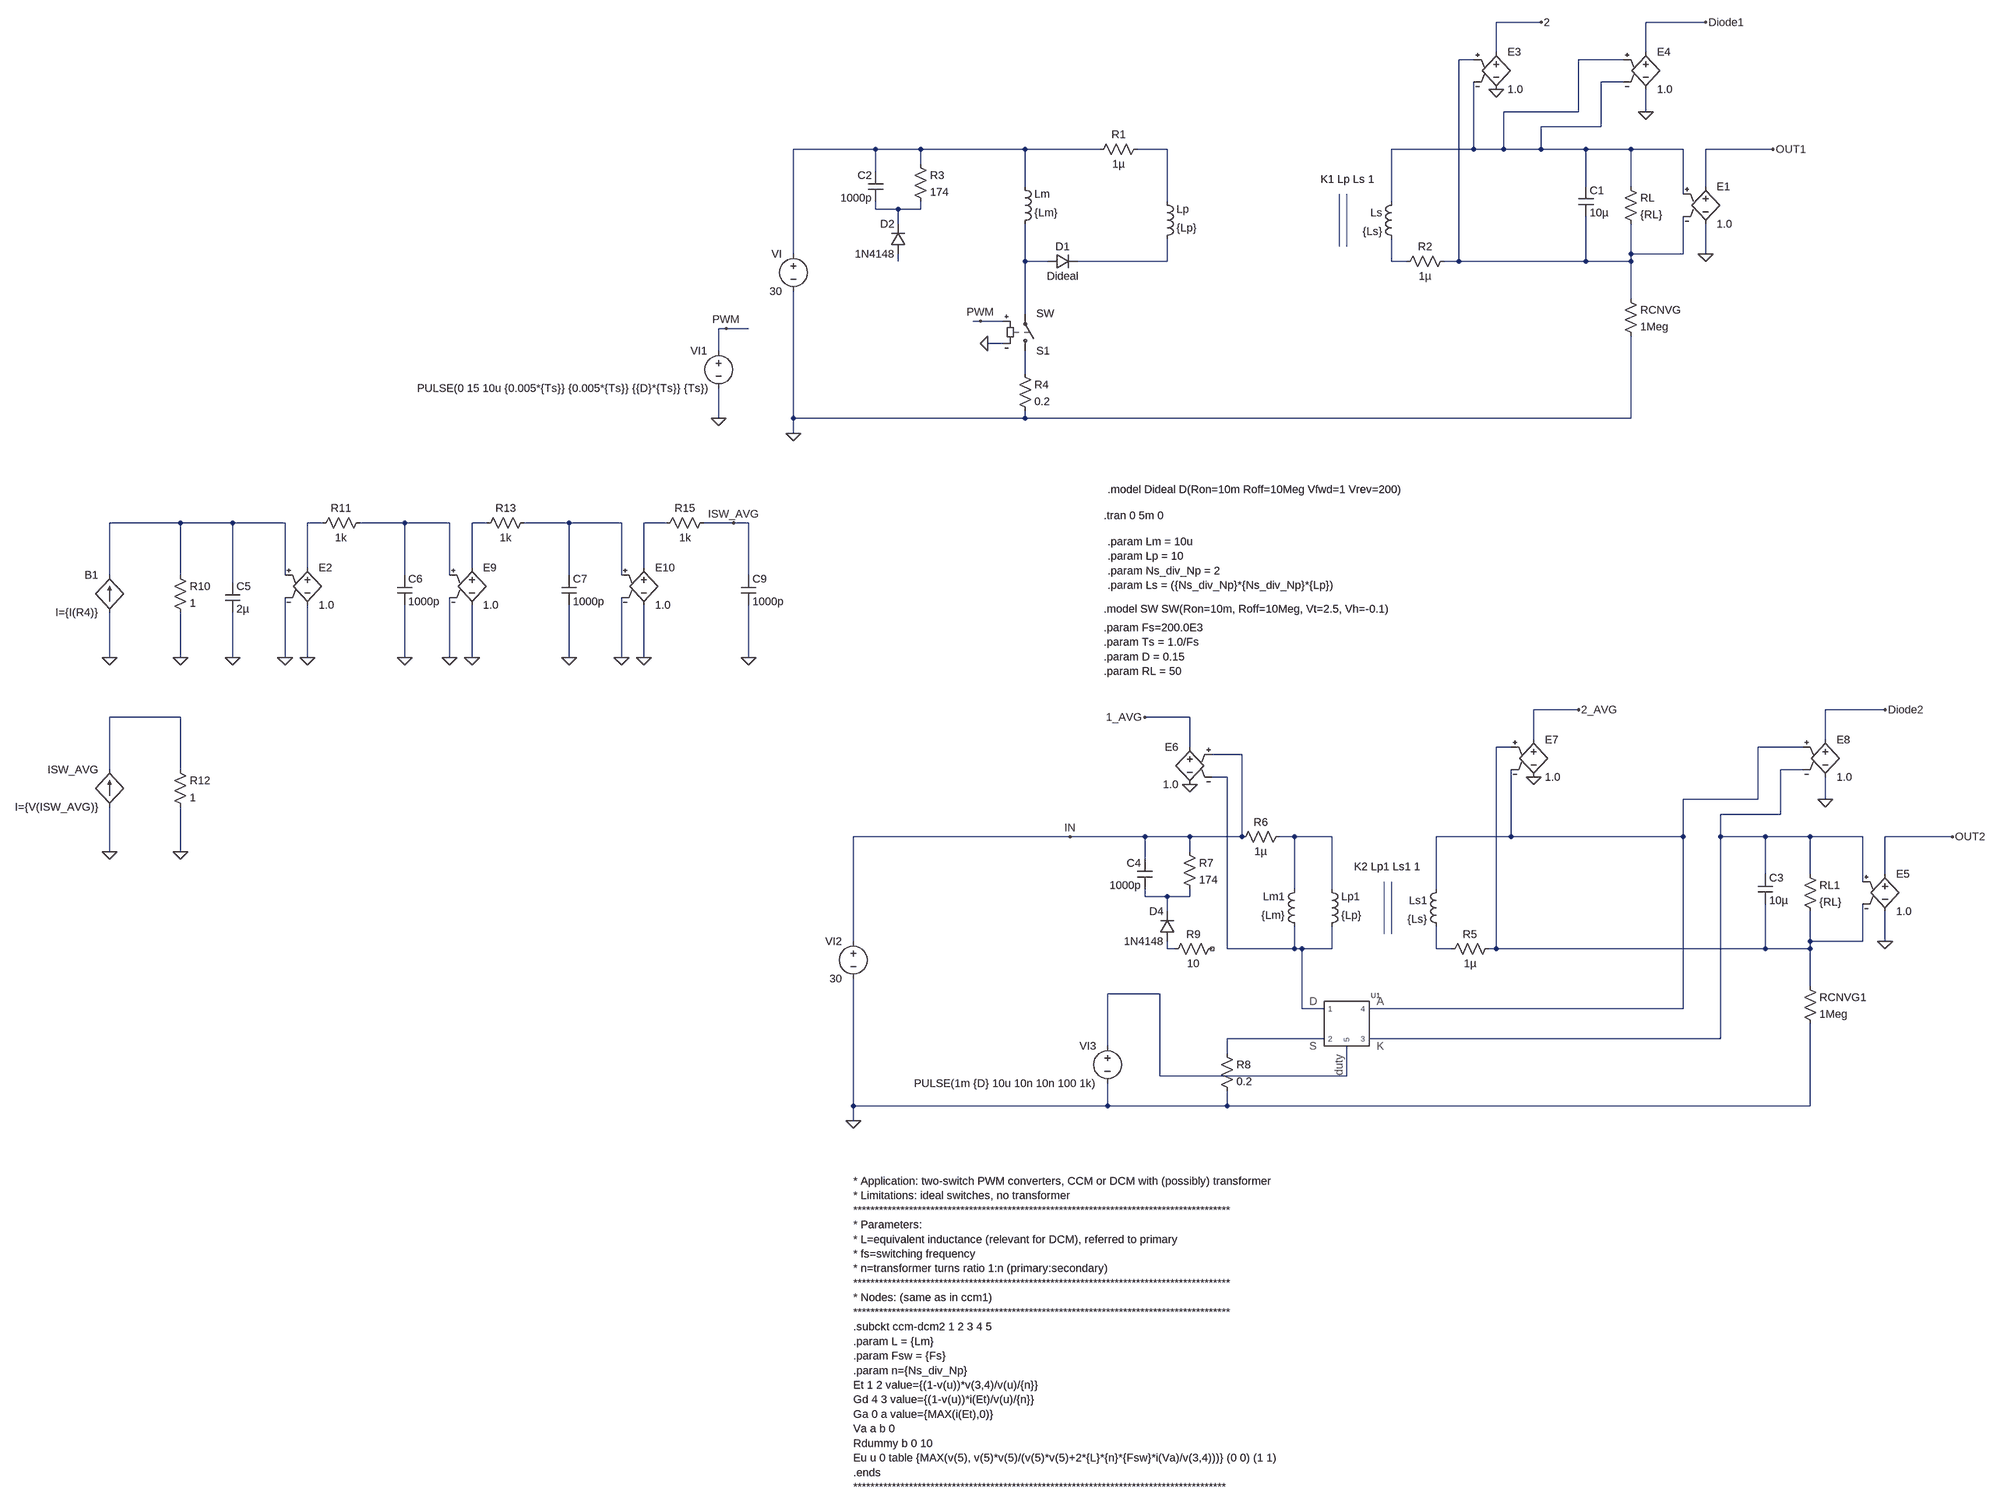
[diagram p0: schematic Flyback_Basic_Model_Diode_Moved_to_Primary_Side.asc]
Flyback_Basic_Model_Diode_Moved_to_Primary_Side.asc, the LTspice schematic file:
Version 4.1
SHEET 1 1712 3524
WIRE 624 -288 528 -288
WIRE 976 -288 848 -288
WIRE 528 -224 528 -288
WIRE 848 -224 848 -288
WIRE 480 -208 448 -208
WIRE 800 -208 704 -208
WIRE 800 -160 752 -160
WIRE 704 -96 704 -208
WIRE 704 -96 544 -96
WIRE 848 -96 848 -144
WIRE 752 -64 752 -160
WIRE 752 -64 624 -64
WIRE -800 -16 -976 -16
WIRE -704 -16 -800 -16
WIRE -480 -16 -704 -16
WIRE -320 -16 -480 -16
WIRE -176 -16 -240 -16
WIRE 480 -16 480 -160
WIRE 480 -16 304 -16
WIRE 544 -16 544 -96
WIRE 544 -16 480 -16
WIRE 624 -16 624 -64
WIRE 624 -16 544 -16
WIRE 720 -16 624 -16
WIRE 816 -16 720 -16
WIRE 928 -16 816 -16
WIRE 1120 -16 976 -16
WIRE -704 16 -704 -16
WIRE -800 32 -800 -16
WIRE -480 64 -480 -16
WIRE 720 64 720 -16
WIRE 816 64 816 -16
WIRE 976 64 976 -16
WIRE 928 80 928 -16
WIRE -176 96 -176 -16
WIRE 304 96 304 -16
WIRE -800 112 -800 96
WIRE -752 112 -800 112
WIRE -704 112 -704 96
WIRE -704 112 -752 112
WIRE -752 144 -752 112
WIRE -976 208 -976 -16
WIRE 816 208 816 144
WIRE 928 208 928 128
WIRE 928 208 816 208
WIRE 976 208 976 144
WIRE -752 224 -752 208
WIRE -480 224 -480 144
WIRE -432 224 -480 224
WIRE -176 224 -176 176
WIRE -176 224 -368 224
WIRE 304 224 304 176
WIRE 336 224 304 224
WIRE 448 224 448 -208
WIRE 448 224 416 224
WIRE 720 224 720 128
WIRE 720 224 448 224
WIRE 816 224 816 208
WIRE 816 224 720 224
WIRE 816 304 816 224
WIRE -480 336 -480 224
WIRE -576 352 -592 352
WIRE -528 352 -576 352
WIRE -1120 368 -1136 368
WIRE -1072 368 -1120 368
WIRE -528 400 -560 400
WIRE -1136 416 -1136 368
WIRE -480 464 -480 416
WIRE -1136 560 -1136 496
WIRE -976 560 -976 288
WIRE -480 560 -480 544
WIRE -480 560 -976 560
WIRE 816 560 816 384
WIRE 816 560 -480 560
WIRE -976 592 -976 560
WIRE -2288 784 -2448 784
WIRE -2176 784 -2288 784
WIRE -2064 784 -2176 784
WIRE -1984 784 -2016 784
WIRE -1808 784 -1904 784
WIRE -1712 784 -1808 784
WIRE -1632 784 -1664 784
WIRE -1456 784 -1552 784
WIRE -1344 784 -1456 784
WIRE -1248 784 -1296 784
WIRE -1104 784 -1168 784
WIRE -1072 784 -1104 784
WIRE -2016 880 -2016 784
WIRE -1664 880 -1664 784
WIRE -1296 880 -1296 784
WIRE -2448 896 -2448 784
WIRE -2288 896 -2288 784
WIRE -2064 896 -2064 784
WIRE -1808 896 -1808 784
WIRE -1712 896 -1712 784
WIRE -1456 896 -1456 784
WIRE -1344 896 -1344 784
WIRE -1072 896 -1072 784
WIRE -2176 912 -2176 784
WIRE -2448 1072 -2448 976
WIRE -2288 1072 -2288 976
WIRE -2176 1072 -2176 976
WIRE -2064 1072 -2064 944
WIRE -2016 1072 -2016 960
WIRE -1808 1072 -1808 960
WIRE -1712 1072 -1712 944
WIRE -1664 1072 -1664 960
WIRE -1456 1072 -1456 960
WIRE -1344 1072 -1344 944
WIRE -1296 1072 -1296 960
WIRE -1072 1072 -1072 960
WIRE 704 1184 608 1184
WIRE 1360 1184 1232 1184
WIRE -2288 1200 -2448 1200
WIRE -128 1200 -224 1200
WIRE 608 1248 608 1184
WIRE 1232 1248 1232 1184
WIRE -128 1264 -128 1200
WIRE 560 1264 528 1264
WIRE 1184 1264 1088 1264
WIRE -16 1280 -80 1280
WIRE -2448 1312 -2448 1200
WIRE -2288 1312 -2288 1200
WIRE 1184 1312 1136 1312
WIRE -48 1328 -80 1328
WIRE 1088 1376 1088 1264
WIRE 1088 1376 928 1376
WIRE 1232 1376 1232 1328
WIRE 1136 1408 1136 1312
WIRE 1136 1408 1008 1408
WIRE -384 1456 -848 1456
WIRE -224 1456 -384 1456
WIRE -128 1456 -224 1456
WIRE -16 1456 -16 1280
WIRE -16 1456 -128 1456
WIRE 96 1456 64 1456
WIRE 176 1456 96 1456
WIRE 560 1456 560 1312
WIRE 560 1456 400 1456
WIRE 928 1456 928 1376
WIRE 928 1456 560 1456
WIRE 1008 1456 1008 1408
WIRE 1104 1456 1008 1456
WIRE 1200 1456 1104 1456
WIRE 1312 1456 1200 1456
WIRE 1504 1456 1360 1456
WIRE -2448 1488 -2448 1392
WIRE -2288 1488 -2288 1392
WIRE -128 1488 -128 1456
WIRE -224 1504 -224 1456
WIRE 1104 1536 1104 1456
WIRE 1200 1536 1200 1456
WIRE 1360 1536 1360 1456
WIRE 1312 1552 1312 1456
WIRE 96 1568 96 1456
WIRE 176 1568 176 1456
WIRE 400 1568 400 1456
WIRE -224 1584 -224 1568
WIRE -176 1584 -224 1584
WIRE -128 1584 -128 1568
WIRE -128 1584 -176 1584
WIRE -176 1616 -176 1584
WIRE -848 1680 -848 1456
WIRE 1200 1680 1200 1616
WIRE 1312 1680 1312 1600
WIRE 1312 1680 1200 1680
WIRE 1360 1680 1360 1616
WIRE -176 1696 -176 1680
WIRE -160 1696 -176 1696
WIRE -48 1696 -48 1328
WIRE 96 1696 96 1648
WIRE 96 1696 -48 1696
WIRE 112 1696 96 1696
WIRE 176 1696 176 1648
WIRE 176 1696 112 1696
WIRE 400 1696 400 1648
WIRE 432 1696 400 1696
WIRE 528 1696 528 1264
WIRE 528 1696 512 1696
WIRE 1104 1696 1104 1600
WIRE 1104 1696 528 1696
WIRE 1200 1696 1200 1680
WIRE 1200 1696 1104 1696
WIRE 1200 1776 1200 1696
WIRE -192 1792 -304 1792
WIRE 112 1824 112 1696
WIRE 160 1824 112 1824
WIRE 928 1824 928 1456
WIRE 928 1824 256 1824
WIRE 160 1888 -48 1888
WIRE 1008 1888 1008 1456
WIRE 1008 1888 256 1888
WIRE -304 1904 -304 1792
WIRE -48 1920 -48 1888
WIRE -192 1968 -192 1792
WIRE 208 1968 208 1904
WIRE 208 1968 -192 1968
WIRE -848 2032 -848 1760
WIRE -304 2032 -304 1984
WIRE -304 2032 -848 2032
WIRE -48 2032 -48 2000
WIRE -48 2032 -304 2032
WIRE 1200 2032 1200 1856
WIRE 1200 2032 -48 2032
WIRE -848 2064 -848 2032
FLAG -976 592 0
FLAG 976 208 0
FLAG 1120 -16 OUT1
FLAG 528 -144 0
FLAG 624 -288 2
FLAG 848 -96 0
FLAG 976 -288 Diode1
FLAG -848 2064 0
FLAG 1360 1680 0
FLAG 1504 1456 OUT2
FLAG -128 1344 0
FLAG 608 1328 0
FLAG -224 1200 1_AVG
FLAG 704 1184 2_AVG
FLAG -384 1456 IN
FLAG 1232 1376 0
FLAG 1360 1184 Diode2
FLAG -1120 368 PWM
FLAG -1136 560 0
FLAG -560 400 0
FLAG -576 352 PWM
FLAG -2176 1072 0
FLAG -2448 1072 0
FLAG -2288 1072 0
FLAG -2064 1072 0
FLAG -2016 1072 0
FLAG -1808 1072 0
FLAG -2448 1488 0
FLAG -2288 1488 0
FLAG -1104 784 ISW_AVG
FLAG -1712 1072 0
FLAG -1664 1072 0
FLAG -1456 1072 0
FLAG -1344 1072 0
FLAG -1296 1072 0
FLAG -1072 1072 0
SYMBOL ind -192 192 M180
WINDOW 0 36 80 Left 2
WINDOW 3 36 40 Left 2
SYMATTR InstName Lp
SYMATTR Value {Lp}
SYMATTR Type ind
SYMBOL ind 320 80 M0
SYMATTR InstName Ls
SYMATTR Value {Ls}
SYMATTR Type ind
SYMBOL voltage -976 192 M0
WINDOW 123 0 0 Left 0
WINDOW 39 0 0 Left 0
SYMATTR InstName VI
SYMATTR Value 30
SYMBOL voltage -1136 400 M0
WINDOW 123 0 0 Left 0
WINDOW 39 0 0 Left 0
SYMATTR InstName VI1
SYMATTR Value PULSE(0 15 10u {0.005*{Ts}} {0.005*{Ts}} {{D}*{Ts}} {Ts})
SYMBOL res 800 48 R0
SYMATTR InstName RL
SYMATTR Value {RL}
SYMBOL cap 704 64 R0
SYMATTR InstName C1
SYMATTR Value 10µ
SYMBOL diode -432 208 M90
WINDOW 0 0 32 VBottom 2
WINDOW 3 32 32 VTop 2
SYMATTR InstName D1
SYMATTR Value Dideal
SYMBOL res 800 288 R0
SYMATTR InstName RCNVG
SYMATTR Value 1Meg
SYMBOL e 976 48 R0
SYMATTR InstName E1
SYMATTR Value 1.0
SYMBOL res 432 208 R90
WINDOW 0 0 56 VBottom 2
WINDOW 3 32 56 VTop 2
SYMATTR InstName R2
SYMATTR Value 1µ
SYMBOL res -336 0 R270
WINDOW 0 32 56 VTop 2
WINDOW 3 0 56 VBottom 2
SYMATTR InstName R1
SYMATTR Value 1µ
SYMBOL e 528 -240 R0
SYMATTR InstName E3
SYMATTR Value 1.0
SYMBOL sw -480 432 M180
SYMATTR InstName S1
SYMBOL diode -736 208 R180
WINDOW 0 24 64 Left 2
WINDOW 3 24 0 Left 2
SYMATTR InstName D2
SYMATTR Value 1N4148
SYMBOL cap -784 32 M0
SYMATTR InstName C2
SYMATTR Value 1000p
SYMBOL res -720 0 R0
SYMATTR InstName R3
SYMATTR Value 174
SYMBOL e 848 -240 R0
SYMATTR InstName E4
SYMATTR Value 1.0
SYMBOL ind 160 1664 M180
WINDOW 0 36 80 Left 2
WINDOW 3 36 40 Left 2
SYMATTR InstName Lp1
SYMATTR Value {Lp}
SYMATTR Type ind
SYMBOL ind 416 1552 M0
SYMATTR InstName Ls1
SYMATTR Value {Ls}
SYMATTR Type ind
SYMBOL voltage -848 1664 M0
WINDOW 123 0 0 Left 0
WINDOW 39 0 0 Left 0
SYMATTR InstName VI2
SYMATTR Value 30
SYMBOL res 1184 1520 R0
SYMATTR InstName RL1
SYMATTR Value {RL}
SYMBOL cap 1088 1536 R0
SYMATTR InstName C3
SYMATTR Value 10µ
SYMBOL res 1184 1760 R0
SYMATTR InstName RCNVG1
SYMATTR Value 1Meg
SYMBOL e 1360 1520 R0
SYMATTR InstName E5
SYMATTR Value 1.0
SYMBOL res 528 1680 R90
WINDOW 0 0 56 VBottom 2
WINDOW 3 32 56 VTop 2
SYMATTR InstName R5
SYMATTR Value 1µ
SYMBOL res -32 1472 R270
WINDOW 0 32 56 VTop 2
WINDOW 3 0 56 VBottom 2
SYMATTR InstName R6
SYMATTR Value 1µ
SYMBOL e -128 1248 M0
SYMATTR InstName E6
SYMATTR Value 1.0
SYMBOL e 608 1232 R0
SYMATTR InstName E7
SYMATTR Value 1.0
SYMBOL diode -160 1680 R180
WINDOW 0 24 64 Left 2
WINDOW 3 24 0 Left 2
SYMATTR InstName D4
SYMATTR Value 1N4148
SYMBOL cap -208 1504 M0
SYMATTR InstName C4
SYMATTR Value 1000p
SYMBOL res -144 1472 R0
SYMATTR InstName R7
SYMATTR Value 174
SYMBOL e 1232 1232 R0
SYMATTR InstName E8
SYMATTR Value 1.0
SYMBOL ccm-dcm2 208 1856 R0
SYMATTR InstName U1
SYMBOL voltage -304 1888 M0
WINDOW 123 0 0 Left 0
WINDOW 39 0 0 Left 0
SYMATTR InstName VI3
SYMATTR Value PULSE(1m {D} 10u 10n 10n 100 1k)
SYMBOL res -64 1904 R0
SYMATTR InstName R8
SYMATTR Value 0.2
SYMBOL res -64 1680 R90
WINDOW 0 0 56 VBottom 2
WINDOW 3 32 56 VTop 2
SYMATTR InstName R9
SYMATTR Value 10
SYMBOL ind -496 160 M180
WINDOW 0 36 80 Left 2
WINDOW 3 36 40 Left 2
SYMATTR InstName Lm
SYMATTR Value {Lm}
SYMBOL ind 112 1664 R180
WINDOW 0 36 80 Left 2
WINDOW 3 36 40 Left 2
SYMATTR InstName Lm1
SYMATTR Value {Lm}
SYMBOL res -496 448 R0
SYMATTR InstName R4
SYMATTR Value 0.2
SYMBOL bi -2448 976 R180
WINDOW 0 24 80 Left 2
WINDOW 3 24 0 Left 2
SYMATTR InstName B1
SYMATTR Value I={I(R4)}
SYMBOL res -2304 880 R0
SYMATTR InstName R10
SYMATTR Value 1
SYMBOL cap -2192 912 R0
SYMATTR InstName C5
SYMATTR Value 2µ
SYMBOL e -2016 864 R0
SYMATTR InstName E2
SYMATTR Value 1.0
SYMBOL res -1888 768 R90
WINDOW 0 0 56 VBottom 2
WINDOW 3 32 56 VTop 2
SYMATTR InstName R11
SYMATTR Value 1k
SYMBOL cap -1824 896 R0
SYMATTR InstName C6
SYMATTR Value 1000p
SYMBOL bi -2448 1392 R180
WINDOW 0 24 80 Left 2
WINDOW 3 24 0 Left 2
SYMATTR InstName ISW_AVG
SYMATTR Value I={V(ISW_AVG)}
SYMBOL res -2304 1296 R0
SYMATTR InstName R12
SYMATTR Value 1
SYMBOL e -1664 864 R0
SYMATTR InstName E9
SYMATTR Value 1.0
SYMBOL res -1536 768 R90
WINDOW 0 0 56 VBottom 2
WINDOW 3 32 56 VTop 2
SYMATTR InstName R13
SYMATTR Value 1k
SYMBOL cap -1472 896 R0
SYMATTR InstName C7
SYMATTR Value 1000p
SYMBOL e -1296 864 R0
SYMATTR InstName E10
SYMATTR Value 1.0
SYMBOL res -1152 768 R90
WINDOW 0 0 56 VBottom 2
WINDOW 3 32 56 VTop 2
SYMATTR InstName R15
SYMATTR Value 1k
SYMBOL cap -1088 896 R0
SYMATTR InstName C9
SYMATTR Value 1000p
TEXT 152 48 Left 2 !K1 Lp Ls 1
TEXT -312 768 Left 2 !.tran 0 5m 0
TEXT -312 968 Left 2 !.model SW SW(Ron=10m, Roff=10Meg, Vt=2.5, Vh=-0.1)
TEXT -312 1008 Left 2 !.param Fs=200.0E3\n.param Ts = 1.0/Fs\n.param D = 0.15\n.param RL = 50
TEXT -304 712 Left 2 !.model Dideal D(Ron=10m Roff=10Meg Vfwd=1 Vrev=200)
TEXT -304 824 Left 2 !.param Lm = 10u\n.param Lp = 10\n.param Ns_div_Np = 2\n.param Ls = ({Ns_div_Np}*{Ns_div_Np}*{Lp})
TEXT 224 1520 Left 2 !K2 Lp1 Ls1 1
TEXT -848 2248 Left 2 !* Application: two-switch PWM converters, CCM or DCM with (possibly) transformer\n* Limitations: ideal switches, no transformer\n****************************************************************************************\n* Parameters:\n* L=equivalent inductance (relevant for DCM), referred to primary\n* fs=switching frequency\n* n=transformer turns ratio 1:n (primary:secondary)\n****************************************************************************************\n* Nodes: (same as in ccm1)\n****************************************************************************************\n.subckt ccm-dcm2 1 2 3 4 5\n.param L = {Lm}\n.param Fsw = {Fs}\n.param n={Ns_div_Np}\nEt 1 2 value={(1-v(u))*v(3,4)/v(u)/{n}}\nGd 4 3 value={(1-v(u))*i(Et)/v(u)/{n}}\nGa 0 a value={MAX(i(Et),0)}\nVa a b 0\nRdummy b 0 10\nEu u 0 table {MAX(v(5), v(5)*v(5)/(v(5)*v(5)+2*{L}*{n}*{Fsw}*i(Va)/v(3,4)))} (0 0) (1 1)\n.ends\n***************************************************************************************
LINE Normal 192 192 192 80
LINE Normal 208 192 208 80
LINE Normal 288 1664 288 1552
LINE Normal 304 1664 304 1552

The netlist it stands for:
* Flyback_Basic_Model_Diode_Moved_to_Primary_Side.asc
Lp N008 N004 {Lp}
Ls N002 N009 {Ls}
VI N003 0 30
VI1 PWM 0 PULSE(0 15 10u {0.005*{Ts}} {0.005*{Ts}} {{D}*{Ts}} {Ts})
RL N002 N001 {RL}
C1 N002 N001 10µ
D1 N007 N008 Dideal
RCNVG N001 0 1Meg
E1 OUT1 0 N002 N001 1.0
R2 N001 N009 1µ
R1 N003 N004 1µ
E3 2 0 N001 N002 1.0
S1 N010 N007 PWM 0 SW
D2 N006 N005 1N4148
C2 N003 N005 1000p
R3 N003 N005 174
E4 Diode1 0 N002 N002 1.0
Lp1 N021 N022 {Lp}
Ls1 N019 N025 {Ls}
VI2 IN 0 30
RL1 N020 N018 {RL}
C3 N020 N018 10µ
RCNVG1 N018 0 1Meg
E5 OUT2 0 N020 N018 1.0
R5 N018 N025 1µ
R6 IN N022 1µ
E6 1_AVG 0 IN N021 1.0
E7 2_AVG 0 N018 N019 1.0
D4 N024 N023 1N4148
C4 IN N023 1000p
R7 IN N023 174
E8 Diode2 0 N019 N020 1.0
X§U1 N021 N027 N020 N019 N026 ccm-dcm2  ; pins 1 2 3 4 5
VI3 N026 0 PULSE(1m {D} 10u 10n 10n 100 1k)
R8 N027 0 0.2
R9 NC_01 N024 10
Lm N007 N003 {Lm}
Lm1 N021 N022 {Lm}
R4 N010 0 0.2
B1 0 N011 I={I(R4)}
R10 N011 0 1
C5 N011 0 2µ
E2 N012 0 N011 0 1.0
R11 N013 N012 1k
C6 N013 0 1000p
B§ISW_AVG 0 N017 I={V(ISW_AVG)}
R12 N017 0 1
E9 N014 0 N013 0 1.0
R13 N015 N014 1k
C7 N015 0 1000p
E10 N016 0 N015 0 1.0
R15 ISW_AVG N016 1k
C9 ISW_AVG 0 1000p
.model D D
.lib standard.dio
K1 Lp Ls 1
.tran 0 5m 0
.model SW SW(Ron=10m, Roff=10Meg, Vt=2.5, Vh=-0.1)
.param Fs=200.0E3
.param Ts = 1.0/Fs
.param D = 0.15
.param RL = 50
.model Dideal D(Ron=10m Roff=10Meg Vfwd=1 Vrev=200)
.param Lm = 10u
.param Lp = 10
.param Ns_div_Np = 2
.param Ls = ({Ns_div_Np}*{Ns_div_Np}*{Lp})
K2 Lp1 Ls1 1
* Application: two-switch PWM converters, CCM or DCM with (possibly) transformer
* Limitations: ideal switches, no transformer
****************************************************************************************
* Parameters:
* L=equivalent inductance (relevant for DCM), referred to primary
* fs=switching frequency
* n=transformer turns ratio 1:n (primary:secondary)
****************************************************************************************
* Nodes: (same as in ccm1)
****************************************************************************************
.subckt ccm-dcm2 1 2 3 4 5
.param L = {Lm}
.param Fsw = {Fs}
.param n={Ns_div_Np}
Et 1 2 value={(1-v(u))*v(3,4)/v(u)/{n}}
Gd 4 3 value={(1-v(u))*i(Et)/v(u)/{n}}
Ga 0 a value={MAX(i(Et),0)}
Va a b 0
Rdummy b 0 10
Eu u 0 table {MAX(v(5), v(5)*v(5)/(v(5)*v(5)+2*{L}*{n}*{Fsw}*i(Va)/v(3,4)))} (0 0) (1 1)
.ends
***************************************************************************************
.backanno
.end